# Altium schematic sheet F4_SPI.SchDoc
size A2
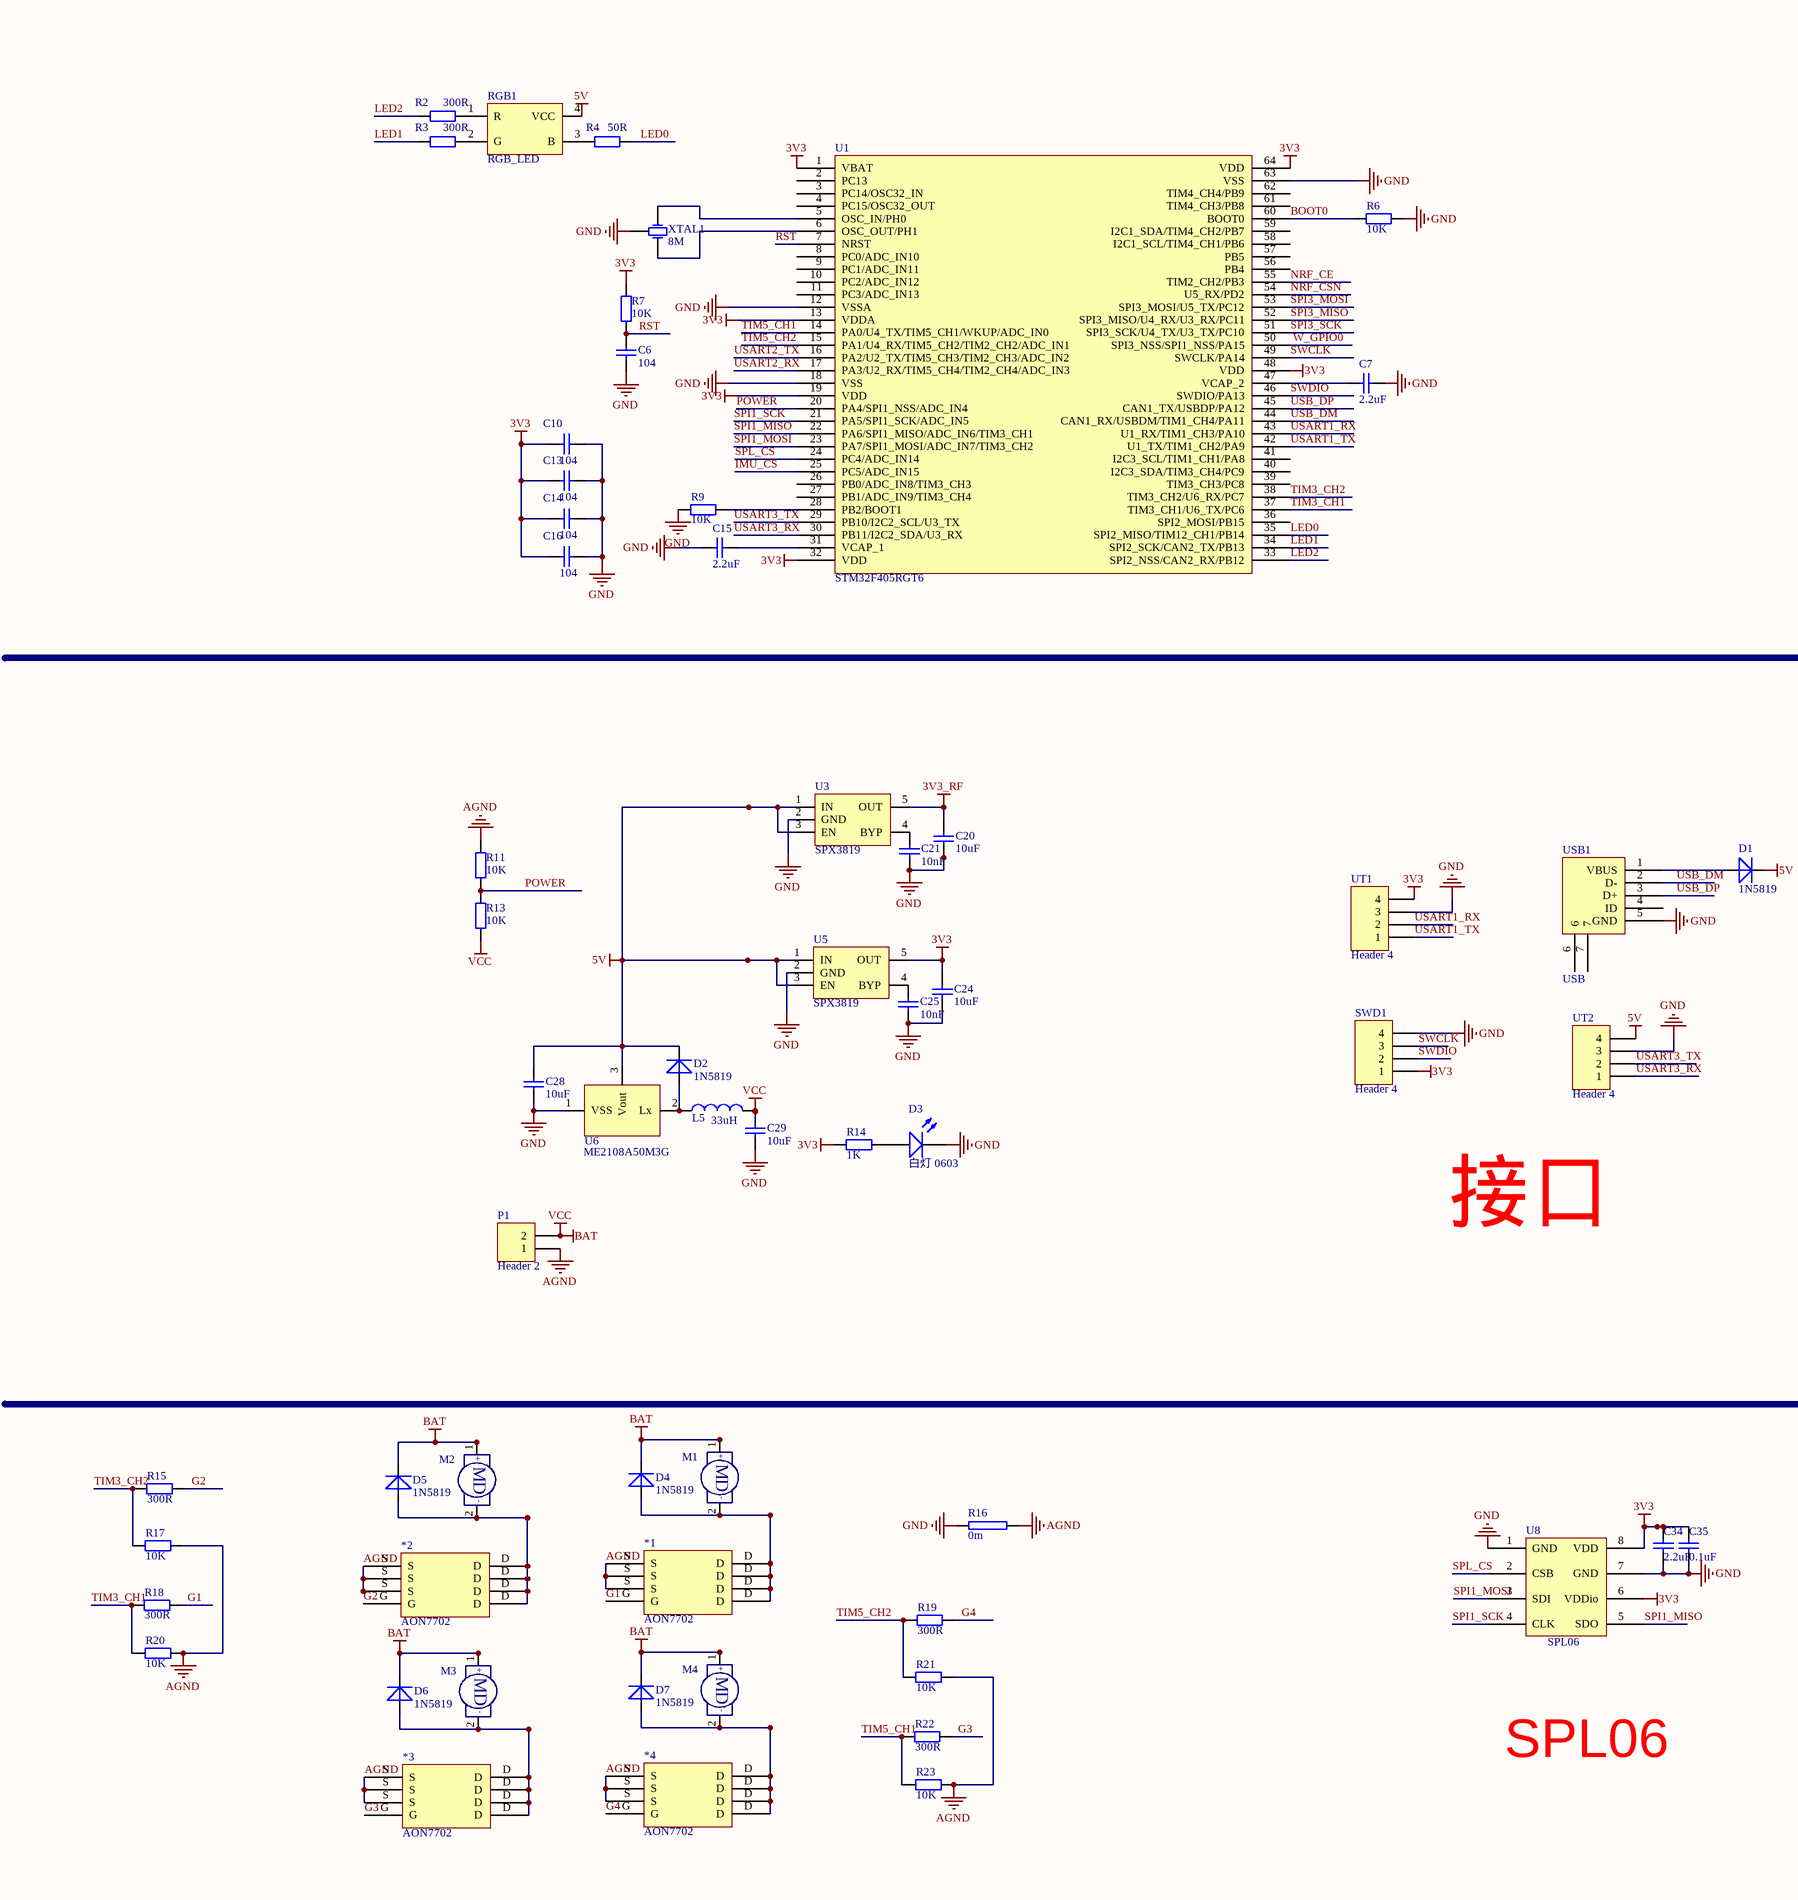
[diagram p0: F4_SPI.SchDoc, left]
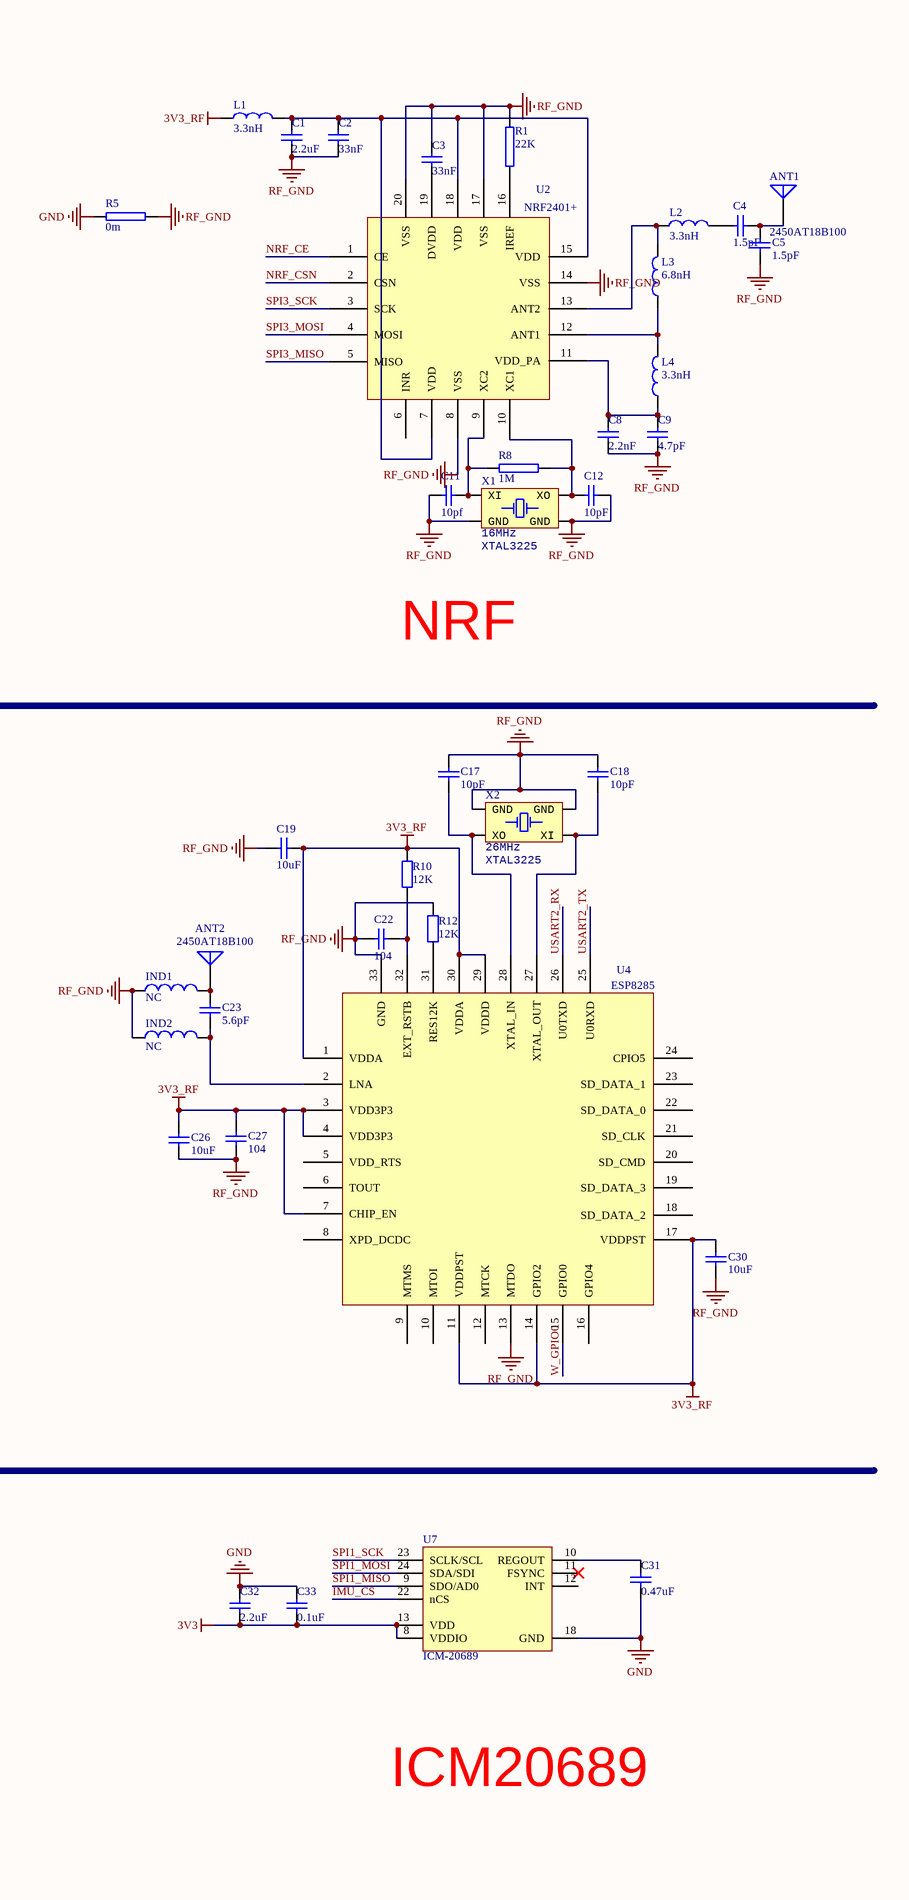
[diagram p1: F4_SPI.SchDoc, right]

## Parts
*1  AON7702
*2  AON7702
*3  AON7702
*4  AON7702
ANT1  2450AT18B100  [2450AT18B100]
ANT2  2450AT18B100  [2450AT18B100]
C1  2.2uF  [0603_C]
C2  33nF  [0603_C]
C3  33nF  [0603_C]
C4  1.5pF  [0603_C]
C5  1.5pF  [0603_C]
C6  104  [0603_C]
C7  2.2uF  [0603_C]
C8  2.2nF  [0603_C]
C9  4.7pF  [0603_C]
C10  104  [0603_C]
C11  10pF  [0603_C]
C12  10pF  [0603_C]
C13  104  [0603_C]
C14  104  [0603_C]
C15  2.2uF  [0603_C]
C16  104  [0603_C]
C17  10pF  [0603_C]
C18  10pF  [0603_C]
C19  10uf  [0603_C]
C20  10uF  [0603_C]
C21  10nF  [0603_C]
C22  104  [0603_C]
C23  5.6pF  [0603_C]
C24  10uF  [0603_C]
C25  10nF  [0603_C]
C26  10uF  [0603_C]
C27  104  [0603_C]
C28  10uF  [1206_C]
C29  10uF  [1206_C]
C30  10uF  [0603_C]
C31  0.47uf  [0603_C]
C32  value 2.2uF  [0603_C]  (hidden comment: 10uF)
C33  value 0.1uF  [0603_C]  (hidden comment: 104)
C34  value 2.2uF  [0603_C]  (hidden comment: 10uf)
C35  value 0.1uF  [0603_C]  (hidden comment: 104)
D1  1N5819  [SOD-323]
D2  1N5819  [SOD-323]
D3  白灯 0603  [0603_LED_S1]
D4  1N5819  [SOD-323]
D5  1N5819  [SOD-323]
D6  1N5819  [SOD-323]
D7  1N5819  [SOD-323]
IND1  NC  [0603_C]
IND2  NC  [0603_C]
L1  3.3nH  [0603_L]
L2  3.3nH  [0603_L]
L3  6.8nH  [0603_L]
L4  3.3nH  [0603_L]
L5  33uH  [CD32]
M1  Motor  [HDR1X2]  (value not drawn)
M2  Motor  [HDR1X2]  (value not drawn)
M3  Motor  [HDR1X2]  (value not drawn)
M4  Motor  [HDR1X2]  (value not drawn)
P1  Header 2  [HDR1X2]
R1  22K  [0603_R]
R2  value 300R  [0603_R]  (hidden comment: 1K)
R3  value 300R  [0603_R]  (hidden comment: 1K)
R4  value 50R  [0603_R]  (hidden comment: 1K)
R5  0m  [0603_R]
R6  10K  [0603_R]
R7  10K  [0603_R]
R8  1M  [0603_R]
R9  10K  [0603_R]
R10  12K  [0603_R]
R11  10K  [0603_R]
R12  12K  [0603_R]
R13  10K  [0603_R]
R14  1K  [0603_R]
R15  300R  [0603_R]
R16  0m  [0603_R]
R17  10K  [0603_R]
R18  300R  [0603_R]
R19  300R  [0603_R]
R20  10K  [0603_R]
R21  10K  [0603_R]
R22  300R  [0603_R]
R23  10K  [0603_R]
RGB1  RGB_LED  [LED_3528_RGB]
SWD1  Header 4  [SIP 1.25]
U1  STM32F405RGT6  [LQFP64 10x10_N]
U2  NRF2401+  [QFN20 4x4_N]
U3  SPX3819  [SOT23-5N]
U4  ESP8285  [QFN32 5x5_M]
U5  SPX3819  [SOT23-5N]
U6  ME2108A50M3G  [SOT23-3N]
U7  ICM-20689  [QFN24 4x4_M]
U8  SPL06  [BMP280]
USB1  USB  [USB-MICRO_D]
UT1  Header 4  [SIP 1.25]
UT2  Header 4  [SIP 1.25]
X1  Type: XTAL3225  [XT_3225_4]  (hidden comment: 16MHz)
X2  Type: XTAL3225  [XT_3225_4]  (hidden comment: 26MHz)
XTAL1  8M  [XTAL-3215-3P]

## Nets
3V3: C10.2 C13.2 C14.2 C16.2 C24.1 C32.1 C33.1 C34.2 C35.2 R7.1 R14.2 SWD1.1 U1.1(VBAT) U1.13(VDDA) U1.19(VDD) U1.32(VDD) U1.48(VDD) U1.64(VDD) U5.5(OUT) U7.8(VDDIO) U7.13(VDD) U8.6(VDDio) U8.8(VDD) UT1.4
3V3_RF: C19.2 C20.1 C26.1 C27.1 C30.1 L1.2 R10.1 U3.5(OUT) U4.1(VDDA) U4.3(VDD3P3) U4.4(VDD3P3) U4.7(CHIP_EN) U4.11(VDDPST) U4.14(GPIO2) U4.17(VDDPST) U4.29(VDDD) U4.30(VDDA)
5V: C28.1 D1.2 D2.2 RGB1.4(VCC) U3.1(IN) U3.3(EN) U5.1(IN) U5.3(EN) U6.3(Vout) UT2.4
AGND: *1.S *2.S *3.S *4.S P1.1 R11.1 R16.1 R17.2 R20.2 R21.2 R23.2
BAT: C29.1 D4.2 D5.2 D6.2 D7.2 L5.2 M1.1 M2.1 M3.1 M4.1 P1.2 R13.2  [also labelled VCC]
GND: C6.2 C7.1 C10.1 C13.1 C14.1 C15.2 C16.1 C20.2 C21.2 C24.2 C25.2 C28.2 C29.2 C31.1 C32.2 C33.2 C34.1 C35.1 D3.K R5.2 R6.1 R9.2 R16.2 SWD1.4 U1.12(VSSA) U1.18(VSS) U1.63(VSS) U3.2(GND) U5.2(GND) U6.1(VSS) U7.18(GND) U8.1(GND) U8.7(GND) USB1.5(GND) UT1.3 UT2.3 XTAL1.2
RF_GND: C1.1 C2.1 C3.2 C5.2 C8.1 C9.1 C11.2 C12.1 C17.1 C18.1 C19.1 C22.1 C26.2 C27.2 C30.2 IND1.1 IND2.1 R1.2 R5.1 R12.1 U2.8(VSS) U2.14(VSS) U2.17(VSS) U2.20(VSS) U4.13(MTDO) U4.33(GND) X1.2(GND) X1.4(GND) X2.2(GND) X2.4(GND)
BOOT0: R6.2 U1.60(BOOT0)
G1: *1.G R18.2
G2: *2.G R15.2
G3: *3.G R22.2
G4: *4.G R19.2
IMU_CS: U1.25(PC5/ADC_IN15) U7.22(nCS)
LED0: R4.2 U1.35(SPI2_MISO/TIM12_CH1/PB14)
LED1: R3.1 U1.34(SPI2_SCK/CAN2_TX/PB13)
LED2: R2.1 U1.33(SPI2_NSS/CAN2_RX/PB12)
NRF_CE: U1.55(TIM2_CH2/PB3) U2.1(CE)
NRF_CSN: U1.54(U5_RX/PD2) U2.2(CSN)
POWER: R11.2 R13.1 U1.20(PA4/SPI1_NSS/ADC_IN4)
RST: C6.1 R7.2 U1.7(NRST)
SPI1_MISO: U1.22(PA6/SPI1_MISO/ADC_IN6/TIM3_CH1) U7.9(SDO/AD0) U8.5(SDO)
SPI1_MOSI: U1.23(PA7/SPI1_MOSI/ADC_IN7/TIM3_CH2) U7.24(SDA/SDI) U8.3(SDI)
SPI1_SCK: U1.21(PA5/SPI1_SCK/ADC_IN5) U7.23(SCLK/SCL) U8.4(CLK)
SPI3_MISO: U1.52(SPI3_MISO/U4_RX/U3_RX/PC11) U2.5(MISO)
SPI3_MOSI: U1.53(SPI3_MOSI/U5_TX/PC12) U2.4(MOSI)
SPI3_SCK: U1.51(SPI3_SCK/U4_TX/U3_TX/PC10) U2.3(SCK)
SPL_CS: U1.24(PC4/ADC_IN14) U8.2(CSB)
SWCLK: SWD1.3 U1.49(SWCLK/PA14)
SWDIO: SWD1.2 U1.46(SWDIO/PA13)
TIM3_CH1: R18.1 R20.1 U1.37(TIM3_CH1/U6_TX/PC6)
TIM3_CH2: R15.1 R17.1 U1.38(TIM3_CH2/U6_RX/PC7)
TIM5_CH1: R22.1 R23.1 U1.14(PA0/U4_TX/TIM5_CH1/WKUP/ADC_IN0)
TIM5_CH2: R19.1 R21.1 U1.15(PA1/U4_RX/TIM5_CH2/TIM2_CH2/ADC_IN1)
USART1_RX: U1.43(U1_RX/TIM1_CH3/PA10) UT1.2
USART1_TX: U1.42(U1_TX/TIM1_CH2/PA9) UT1.1
USART2_RX: U1.17(PA3/U2_RX/TIM5_CH4/TIM2_CH4/ADC_IN3) U4.26(U0TXD)
USART2_TX: U1.16(PA2/U2_TX/TIM5_CH3/TIM2_CH3/ADC_IN2) U4.25(U0RXD)
USART3_RX: U1.30(PB11/I2C2_SDA/U3_RX) UT2.1
USART3_TX: U1.29(PB10/I2C2_SCL/U3_TX) UT2.2
USB_DM: U1.44(CAN1_RX/USBDM/TIM1_CH4/PA11) USB1.2(D-)
USB_DP: U1.45(CAN1_TX/USBDP/PA12) USB1.3(D+)
W_GPIO0: U1.50(SPI3_NSS/SPI1_NSS/PA15) U4.15(GPIO0)
Net*1_D: *1.D D4.1 M1.2
Net*2_D: *2.D D5.1 M2.2
Net*3_D: *3.D D6.1 M3.2
Net*4_D: *4.D D7.1 M4.2
NetANT1_1: ANT1.1(A) C4.1 C5.1
NetANT2_1: ANT2.1(A) C23.1 IND1.2
NetC1_2: C1.2 C2.2 L1.1 U2.7(VDD) U2.15(VDD) U2.18(VDD)
NetC3_1: C3.1 U2.19(DVDD)
NetC4_2: C4.2 L2.1
NetC7_2: C7.2 U1.47(VCAP_2)
NetC8_2: C8.2 C9.2 L4.2 U2.11(VDD_PA)
NetC11_1: C11.1 R8.2 U2.9(XC2) X1.1(XI)
NetC12_2: C12.2 R8.1 U2.10(XC1) X1.3(XO)
NetC15_1: C15.1 U1.31(VCAP_1)
NetC17_2: C17.2 U4.28(XTAL_IN) X2.3(XO)
NetC18_2: C18.2 U4.27(XTAL_OUT) X2.1(XI)
NetC21_1: C21.1 U3.4(BYP)
NetC22_2: C22.2 R10.2 U4.32(EXT_RSTB)
NetC23_2: C23.2 IND2.2 U4.2(LNA)
NetC25_1: C25.1 U5.4(BYP)
NetC31_2: C31.2 U7.10(REGOUT)
NetD1_1: D1.1 USB1.1(VBUS)
NetD2_1: D2.1 L5.1 U6.2(Lx)
NetD3_A: D3.A R14.1
NetL2_2: L2.2 L3.1 U2.13(ANT2)
NetL3_2: L3.2 L4.1 U2.12(ANT1)
NetR1_1: R1.1 U2.16(IREF)
NetR2_2: R2.2 RGB1.1(R)
NetR3_2: R3.2 RGB1.2(G)
NetR4_1: R4.1 RGB1.3(B)
NetR9_1: R9.1 U1.28(PB2/BOOT1)
NetR12_2: R12.2 U4.31(RES12K)
NetU1_5: U1.5(OSC_IN/PH0) XTAL1.1
NetU1_6: U1.6(OSC_OUT/PH1) XTAL1.3

Not connected (* = marked no-connect by the designer): U1 2(PC13) 3(PC14/OSC32_IN) 4(PC15/OSC32_OUT) 8(PC0/ADC_IN10) 9(PC1/ADC_IN11) 10(PC2/ADC_IN12) 11(PC3/ADC_IN13) 26(PB0/ADC_IN8/TIM3_CH3) 27(PB1/ADC_IN9/TIM3_CH4) 36(SPI2_MOSI/PB15) 39(TIM3_CH3/PC8) 40(I2C3_SDA/TIM3_CH4/PC9) 41(I2C3_SCL/TIM1_CH1/PA8) 56(PB4) 57(PB5) 58(I2C1_SCL/TIM4_CH1/PB6) 59(I2C1_SDA/TIM4_CH2/PB7) 61(TIM4_CH3/PB8) 62(TIM4_CH4/PB9); U2 6(INR); U4 5(VDD_RTS) 6(TOUT) 8(XPD_DCDC) 9(MTMS) 10(MTOI) 12(MTCK) 16(GPIO4) 18(SD_DATA_2) 19(SD_DATA_3) 20(SD_CMD) 21(SD_CLK) 22(SD_DATA_0) 23(SD_DATA_1) 24(CPIO5); U7 11(FSYNC)* 12(INT); USB1 4(ID) 6 7

## Notes on the sheet
- NRF
- 接口
- ICM20689
- SPL06
- (in symbol Motor) +; M; D; -

## Library data of the parts
ANT1 ANT2 = Antenna: Generic Antenna; Published: 24-Mar-1999; LatestRevisionDate: 17-Jul-2002; LatestRevisionNote: Re-released for DXP Platform.; PackageReference: PIN1; Publisher: Altium Limited
C1-C35 = Cap: Capacitor; Published: 8-Jun-2000; LatestRevisionDate: 17-Jul-2002; LatestRevisionNote: Re-released for DXP Platform.; PackageReference: RAD-0.3; Publisher: Altium Limited; PackageDescription: Radial Cap, Thru-Hole; 2 Leads; 0.3 in Pin Spacing
  C1 C7 C15: Value: 2.2uF
  C2 C3: Value: 33nF
  C4 C5: Value: 1.5pF
  C6 C10 C13 C14 C16 C22 C27: Value: 104
  C8: Value: 2.2nF
  C9: Value: 4.7pF
  C11: Value: 10pf
  C12 C17 C18: Value: 10pF
  C19 C20 C24 C26 C28-C30: Value: 10uF
  C21 C25: Value: 10nF
  C23: Value: 5.6pF
  C31: Value: 0.47uF
D1 D2 D4-D7 = 1N4007: 二极管
D3 = 0603 白灯: 发光二极管; ComponentLink1Description: 供应商链接; ComponentLink1URL: http://www.szlcsc.com/product/details_2663.html; Package: 0603; Supplier: LC; SuppliersPartNumber: C2290
IND1 IND2 = Inductor: Code_IEC: 1005; Value: 10mH; Published: 8-Jun-2000; LatestRevisionDate: 29-May-2009; LatestRevisionNote: IPC-7351 Footprint Added.; PackageReference: 0402-A; Publisher: Altium Limited; PackageDescription: Chip Inductor; Code_JEITA: 0402
L1-L4 = L1: 电感
L5 = Inductor: Code_IEC: 1005; Published: 8-Jun-2000; LatestRevisionDate: 29-May-2009; LatestRevisionNote: IPC-7351 Footprint Added.; PackageReference: 0402-A; Publisher: Altium Limited; PackageDescription: Chip Inductor; Code_JEITA: 0402; Value: 33uH
M1-M4 = Motor: 直流电机
P1 = Header 2: Header, 2-Pin; Publisher: mazhongwei; Published: 8-August-2017; PackageReference: HDR1X2
R1 R5 R8 R16 = RES
R2-R4 R6 R7 R9-R15 R17-R23 = Res2: Resistor; Published: 8-Jun-2000; LatestRevisionDate: 17-Jul-2002; LatestRevisionNote: Re-released for DXP Platform.; PackageReference: AXIAL-0.4; Publisher: Altium Limited
  R6 R7 R9 R11 R13 R17 R20 R21 R23: Value: 10K
  R10 R12: Value: 12K
  R14: Value: 1K
  R15 R18 R19 R22: Value: 300R
RGB1 = RGB_LED: 三色高亮LED
SWD1 UT1 UT2 = Header 4: Header, 4-Pin; LatestRevisionDate: 17-Jul-2002; LatestRevisionNote: Re-released for DXP Platform.; Publisher: Altium Limited
U1 = STM32F405RGT6: Flaah:256/RAM:48/IO:51
U3 U5 = MIC5219: 3.3V 降压芯片
U4 = ESP8266
U6 = ME2108A50M3G: 5升压芯片
U8 = BMP280
X1 X2 = XTAL_3225_4P: Crystal Oscillator
  X1: Value: 16MHz
  X2: Value: 26MHz
XTAL1 = XTAL1